# EAGLE schematic rgbstripe_fft_pcb (EAGLE 9.6.2)
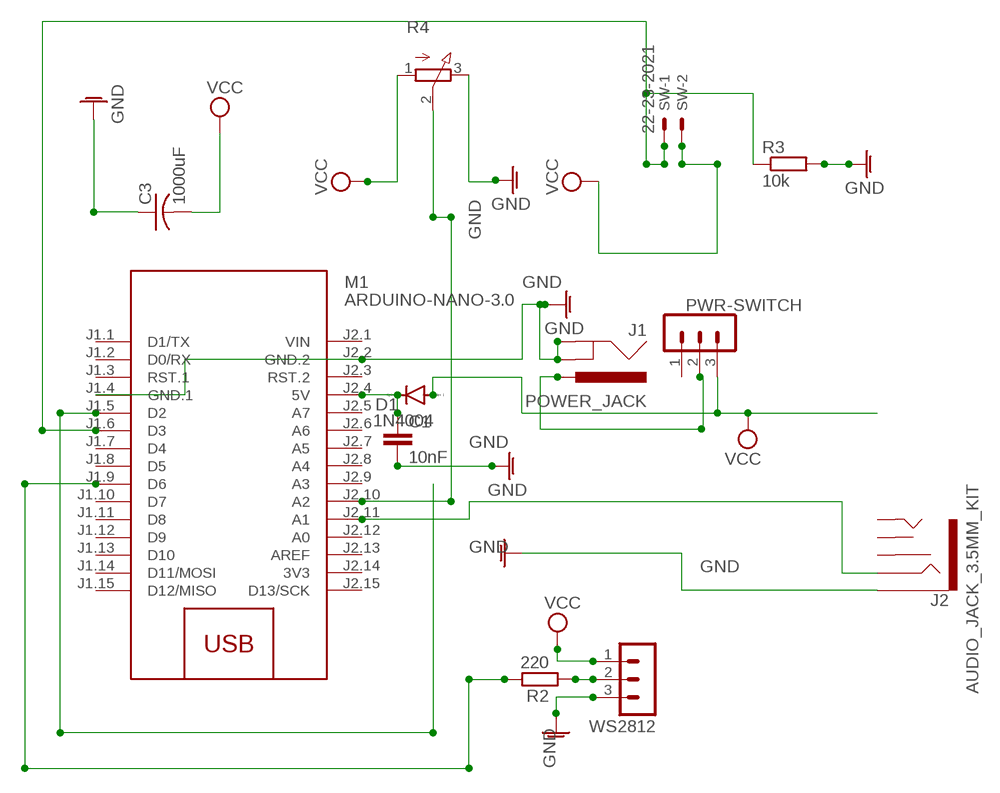
[diagram p0: schematic, sheet 1]

## Parts
C1  10nF  C-EU025-025X050  [C025-025X050]
C3  1000uF  C-US050-024X044  [C050-024X044]
D1  1N4004  [DO41-10]
J1  POWER_JACK  [POWER_JACK_PTH]
J2  AUDIO_JACK_3.5MM_KIT  [AUDIO-JACK-KIT]
M1  ARDUINO-NANO-3.0  [ARDUINO-NANO-3.0]
PWR-SWITCH  MA03-1  [MA03-1]
R2  220  R-EU_0204/5  [0204/5]
R3  10k  R-EU_0204/5  [0204/5]
R4  3RP/1610N  [3RP/1610N]
SW  22-23-2021  [22-23-2021]
WS2812  MA03-1  [MA03-1]

## Nets
GND: C1.2 C3.1 J1.GND J1.GNDBREAK J2.SLEEVE M1.J1.4(GND.1) M1.J2.2(GND.2) R3.2 R4.3(E) WS2812.3
N$1: C1.1 D1.C M1.J2.4(5V)
N$6: J2.RING M1.J2.11(A1)
N$8: M1.J1.5(D2)
N$14: M1.J1.9(D6) R2.2
N$15: M1.J2.10(A2) R4.2(S)
N$16: R2.1 WS2812.2
N$17: M1.J1.6(D3) R3.1 SW.1
N$19: J1.PWR PWR-SWITCH.2
VCC: C3.2 D1.A PWR-SWITCH.3 R4.1(A) SW.2 WS2812.1
Unconnected: J2.RSH J2.TIP J2.TSH M1.J1.1(D1/TX) M1.J1.2(D0/RX) M1.J1.3(RST.1) M1.J1.7(D4) M1.J1.8(D5) M1.J1.10(D7) M1.J1.11(D8) M1.J1.12(D9) M1.J1.13(D10) M1.J1.14(D11/MOSI) M1.J1.15(D12/MISO) M1.J2.3(RST.2) M1.J2.5(A7) M1.J2.6(A6) M1.J2.7(A5) M1.J2.8(A4) M1.J2.9(A3) M1.J2.12(A0) M1.J2.13(AREF) M1.J2.15(D13/SCK) PWR-SWITCH.1

## Power pins joined to a net without a drawn wire
3V3: M1.J2.14(3V3)
VIN: M1.J2.1(VIN)

## Library data of the parts
C1 = resistor:C-EU: CAPACITOR, European symbol
C3 = resistor:C-US: CAPACITOR, American symbol
D1 = diode:1N4004: DIODE general purpose rectifier, 1 A
J1 = SparkFun-Connectors:POWER_JACK: Power Jack Connector This is the standard 5.5mm barrel jack for power. The PTH is the most common, proven, reliable, footprint. The Slot footprint only works if the mill layer is transmitted to the PCB fab house so be warned. Here are the connectors we sell at SparkFun: DC Barrel Power Jack/Connector <https://www.sparkfun.com/products/119> (PRT-00119) DC Barrel Power Jack/Connector (SMD) <https://www.sparkfun.com/products/12748> (PRT-12748) DC Barrel Jack Adapter - Breadboard Compatible <https://www.sparkfun.com/products/10811> (PRT-10811) It is used on this SparkFun product (and many, many others): SparkFun RedBoard - Programmed with Arduino <https://www.sparkfun.com/products/12757> (DEV-12757) Also, if you need a mating power supply or connector, please check these out: Wall Adapter Power Supply - 9VDC 650mA <https://www.sparkfun.com/products/298> (TOL-00298) DC Barrel Jack Adapter - Male <https://www.sparkfun.com/products/10287> (PRT-10287); PROD_ID: CONN-08197
J2 = SparkFun-Connectors:AUDIO_JACK_3.5MM: Audio Jack 3.5mm variants of PTH and SMT stereo audio jack with bypass switches. SparkFun Products: SparkFun SparkPunk Sound Kit <[https://www.sparkfun.com/products/11177]> - PTH MP3 Trigger <https://www.sparkfun.com/products/13720> -3.5mm SMD SparkFun PicoBoard <https://www.sparkfun.com/products/11888>- 2.5mm SMD; PROD_ID: CONN-08774; SF_ID: PRT-08032
M1 = diy-modules-nano:ARDUINO-NANO-3.0: Arduino Nano 3.0 and compatible devices More details available here: https://www.arduino.cc/en/Main/ArduinoBoardNano Click here to find device on ebay.com <http://www.ebay.com/sch/arduino+nano>
PWR-SWITCH WS2812 = con-lstb:MA03-1: PIN HEADER; OC_FARNELL: unknown; OC_NEWARK: unknown
R2 R3 = resistor:R-EU_: RESISTOR, European symbol
R4 = pot:3RP/1610N: 16mm Potentiometer one level Source: http://www.alphapotentiometers.net/html/16mm_pot_2.html
SW = con-molex:22-23-2021: .100" (2.54mm) Center Header - 2 Pin; MF: MOLEX; MPN: 22-23-2021; OC_FARNELL: 1462926; OC_NEWARK: 25C3832